# EasyEDA Pro project ECU_SMD.epro, board PCB
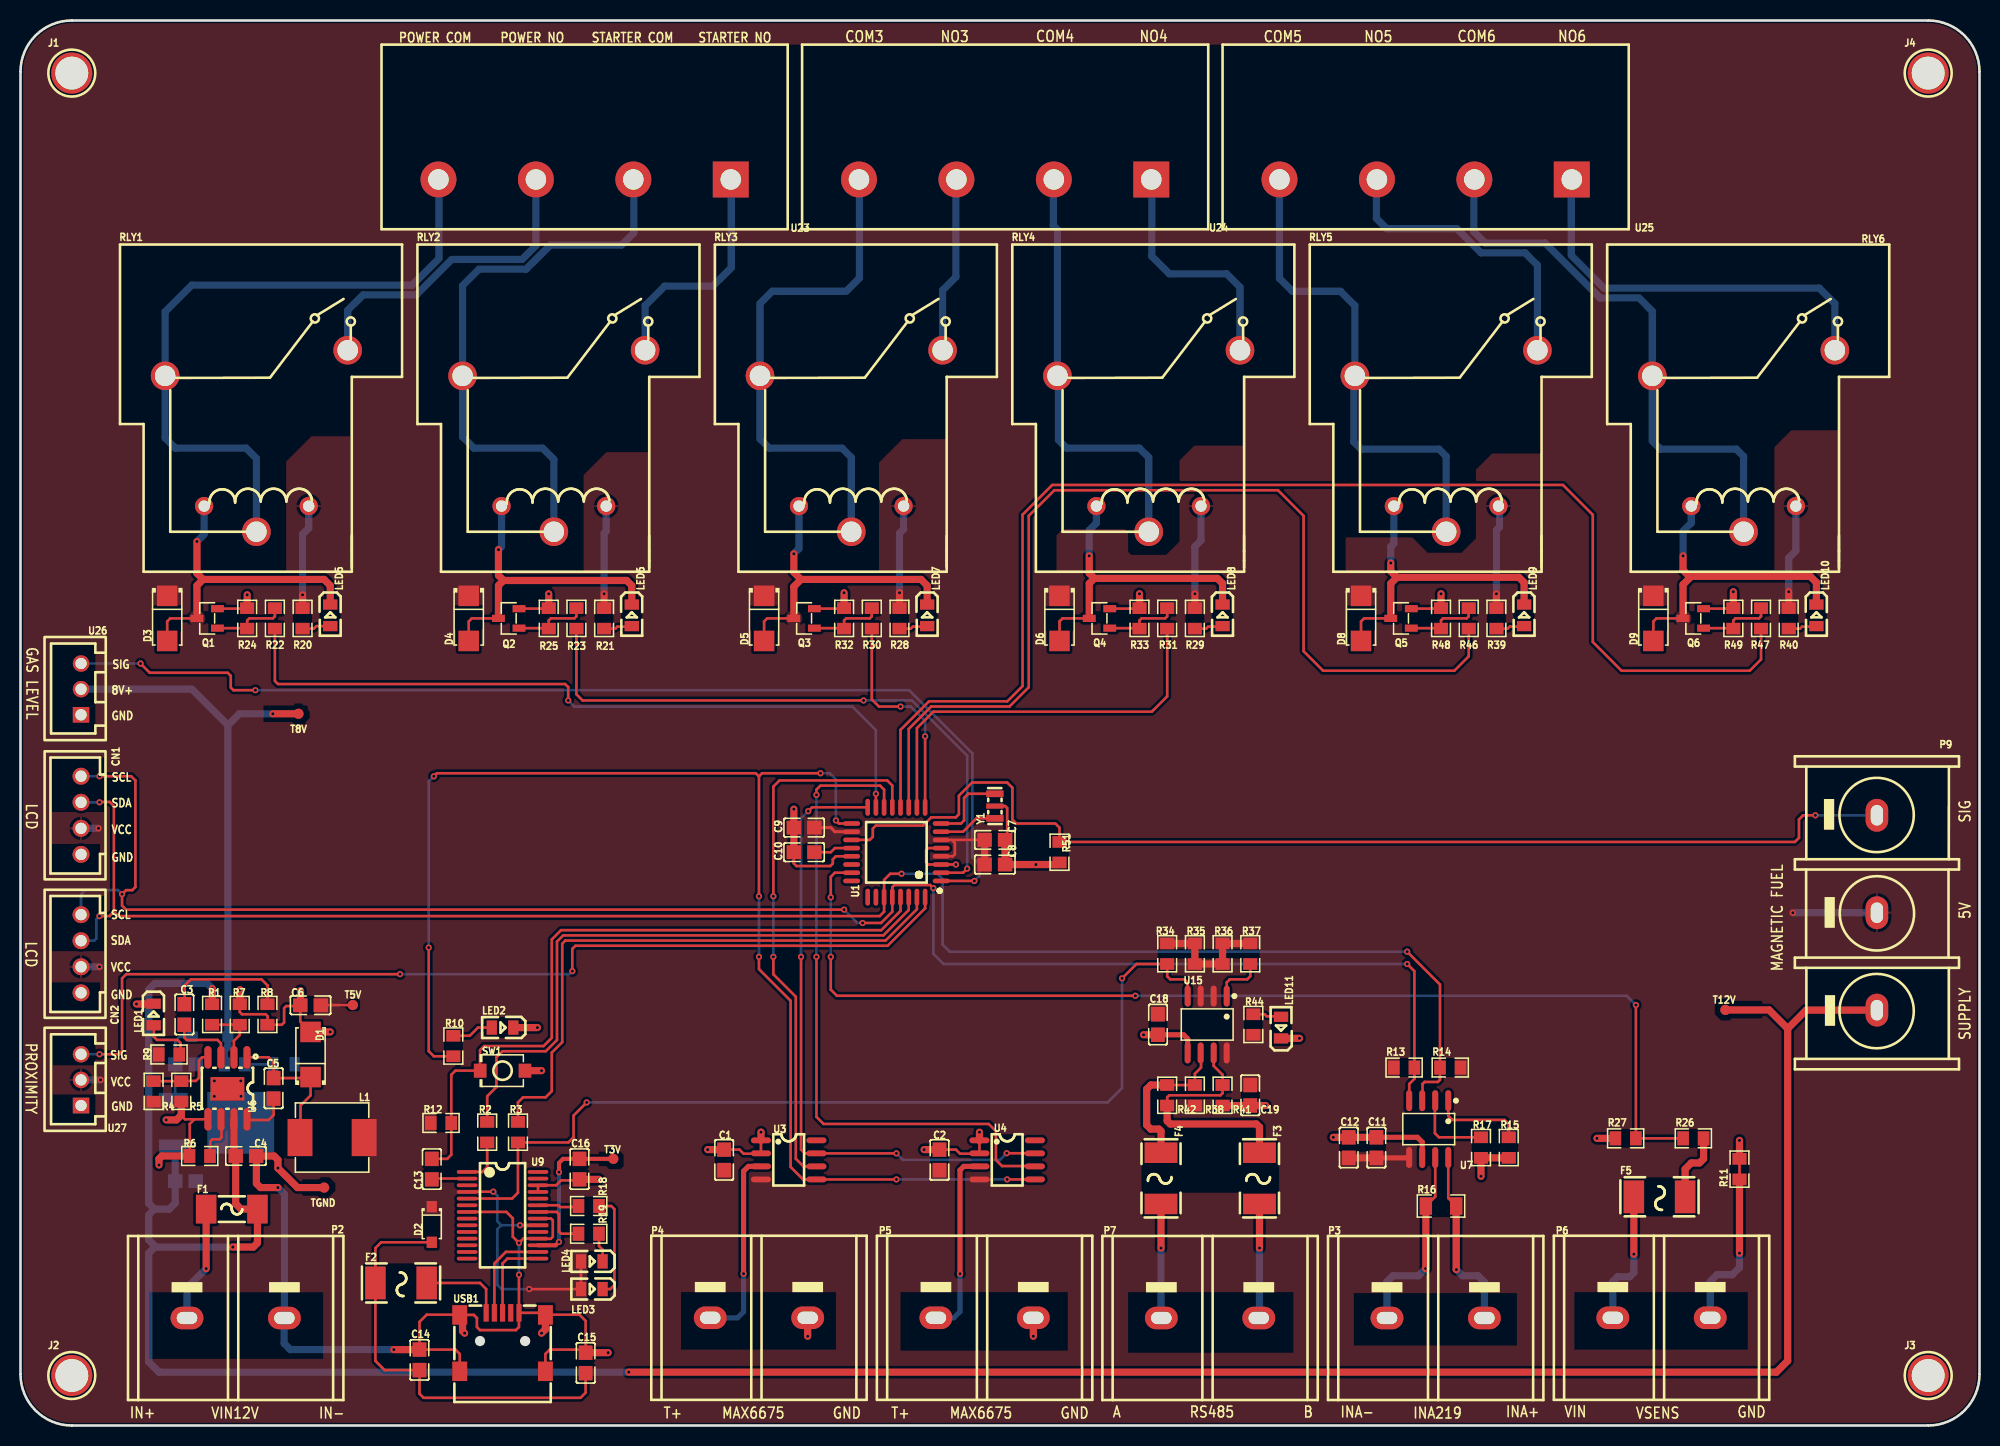
[diagram p2: board, top side]
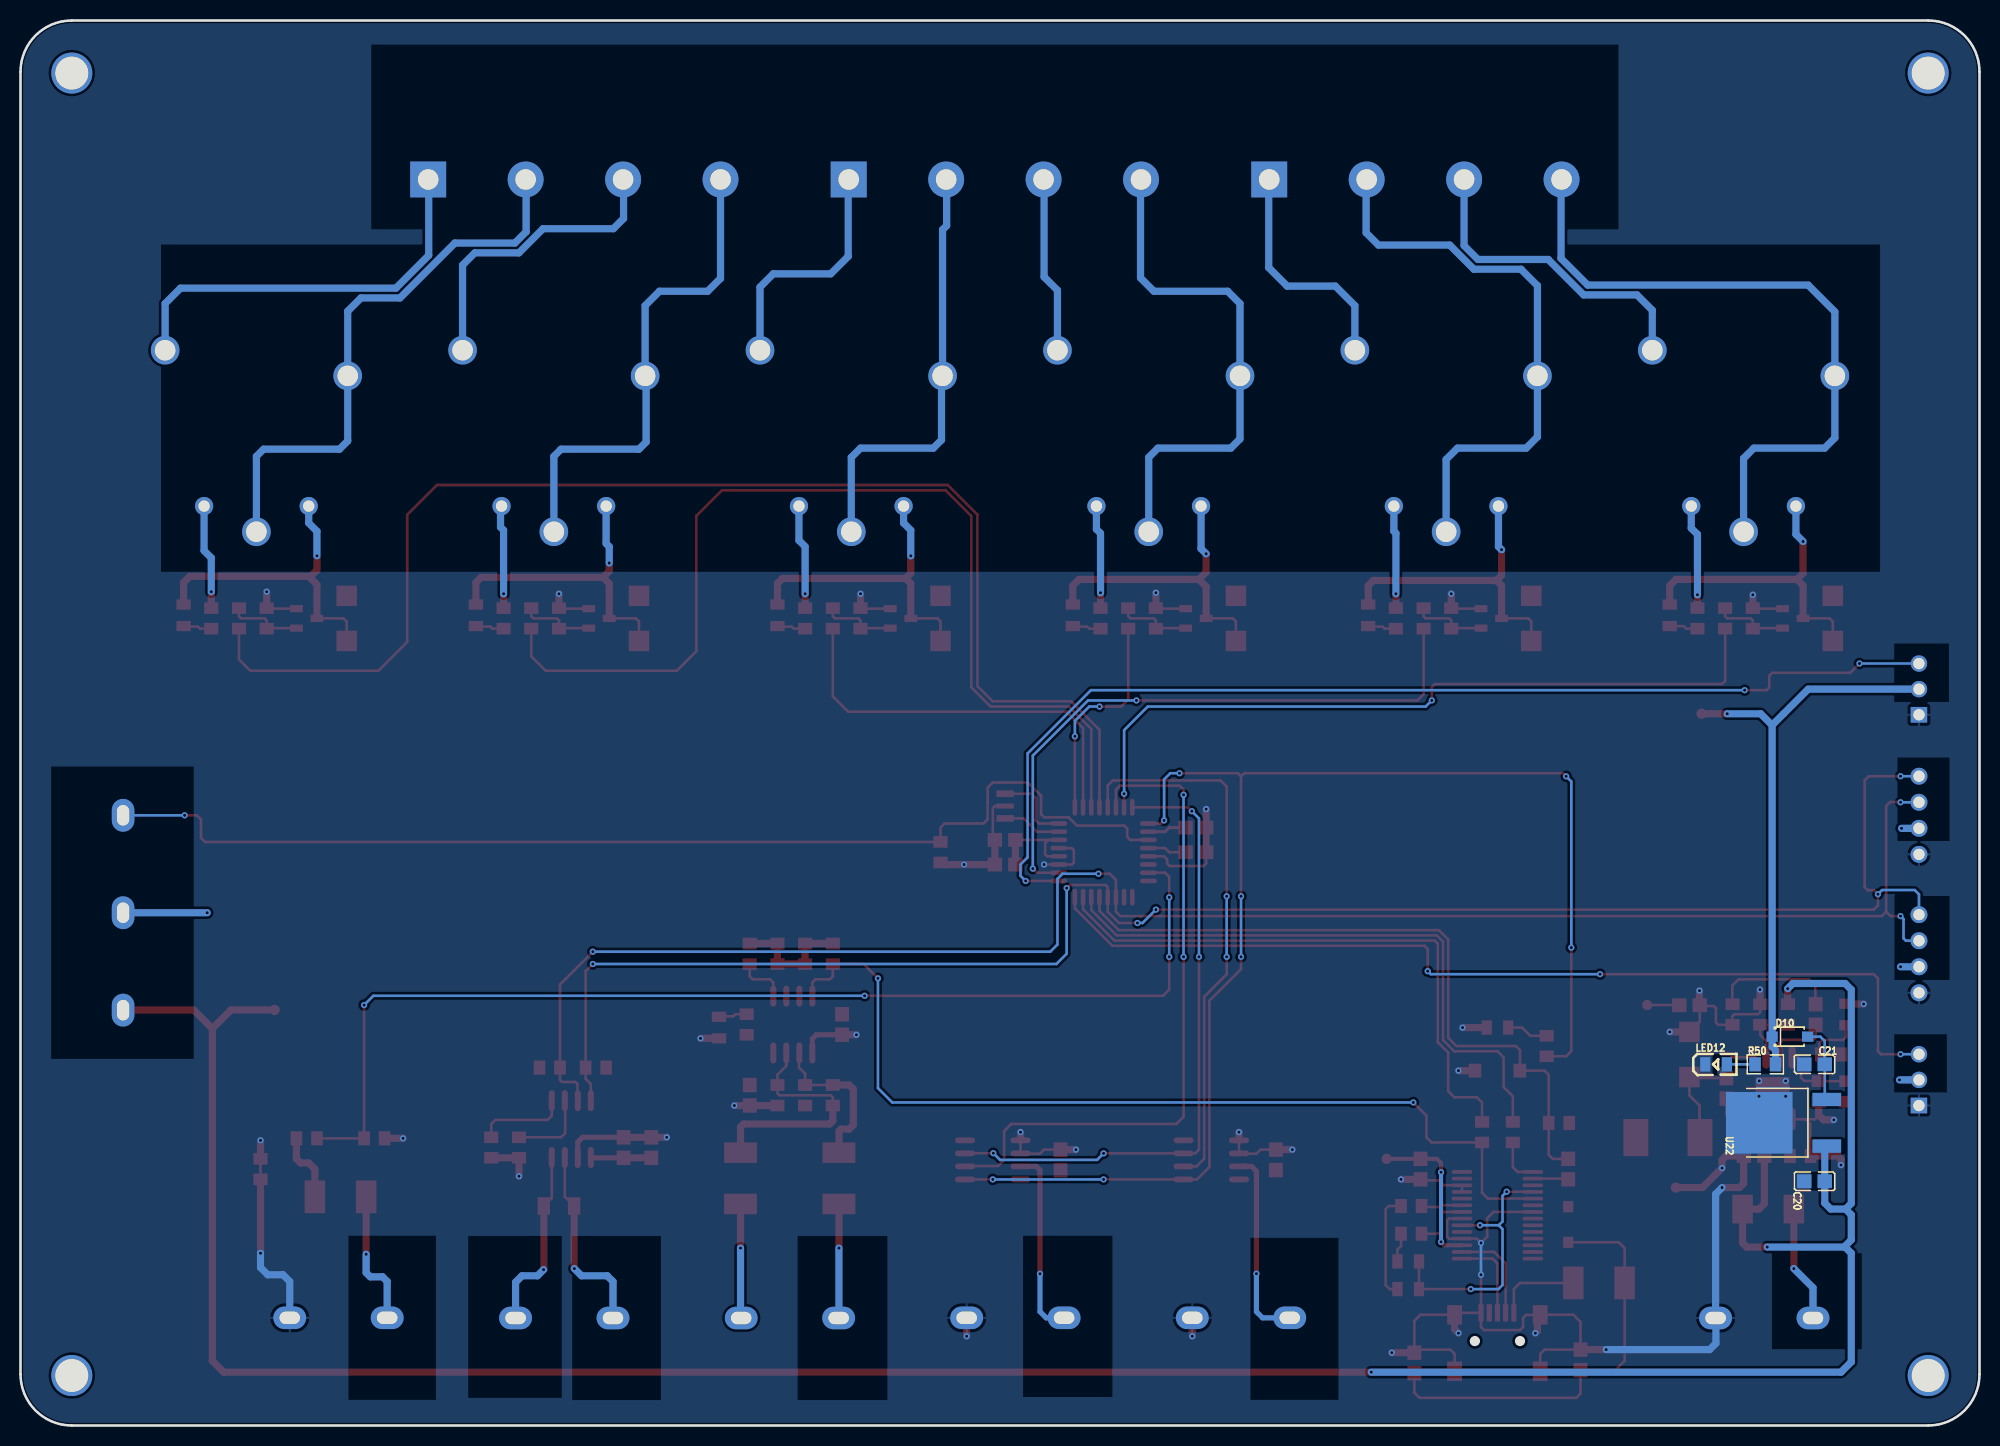
[diagram p3: board, bottom side, seen from below]

Outline 191 x 137 mm; copper layers: Top Layer, Bottom Layer. Coordinates in mm from the lower left corner of the outline.
Outline path: 0,132 0,5 arc(1.46,1.46) 5,0 186,0 arc(189.54,1.46) 191,5 191,132 arc(189.54,135.54) 186,137 5,137 arc(1.46,135.54) 0,132
Stack: Top Layer 0.035mm / Dielectric1 1.51mm FR4 er 4.5 / Bottom Layer 0.035mm

## Design rules (mm)
template: Custom Config
spacing copperThickness1oz (default): track to track 0.254, other pairs 0.152 to 0.3
spacing copperThickness2oz: track to track 0.203, other pairs 0.152 to 0.3
track width copperThickness1oz (default): min 0.127, default 0.254, max 2.54
track width copperThickness2oz: min 0.203, default 0.254, max 2.54
differential pair differentialPair (default): width min 0.127, default 0.254, max 2.54; gap min 0.152, default 0.152
via viaSize (default): diameter min 0.5, default 0.61, max 10; hole min 0.3, default 0.305, max 6.3

## Placement (name value [footprint] x y rotation side)
C1  100nF  [C0805]  68.6 25.9 270 top
C2  100nF  [C0805]  89.6 25.9 270 top
C3  150pF  [C0805]  15.98 40.08 270 top
C4  10uF  [C0805]  21.98 26.28 180 top
C5  100nF  [C0805]  24.68 32.88 90 top
C6  22uF  [C0805]  28.28 40.98 0 top
C7  1uF  [C0805]  95 57.1 180 top
C8  4.7uF  [C0805]  95 54.7 180 top
C9  1uF  [C0805]  76.4 58.3 0 top
C10  100nF  [C0805]  76.4 55.9 0 top
C11  10uF  [C0805]  132.2 27.1 270 top
C12  100nF  [C0805]  129.5 27.1 270 top
C13  100nF  [C0805]  40.1 25 270 top
C14  4.7uF  [C0805]  38.9 6.4 270 top
C15  100nF  [C0805]  55.1 6.1 270 top
C16  100nF  [C0805]  54.5 25 90 top
C18  10uF  [C0805]  110.9 39.1 90 top
C19  100nF  [C0805]  119.9 32.2 90 top
C20  330nF  [C0805]  16.08 23.82 180 bottom
C21  100nF  [C0805]  16.08 35.22 180 bottom
CN1  HCZZ0126-4  [CONN-TH_XH2.54-4P]  5.9 59.5 90 top
CN2  HCZZ0126-4  [CONN-TH_XH2.54-4P]  5.9 46 90 top
D1  SS34  [SMA_L4.3-W2.6-LS5.2-RD]  28.28 36.18 90 top
D2  1N4148W  [SOD-123F_L2.7-W1.6-LS3.8-RD]  40.1 19.6 270 top
D3  SS34  [SMA_L4.3-W2.6-LS5.2-RD]  14.3 78.7 270 top
D4  SS34  [SMA_L4.3-W2.6-LS5.2-RD]  43.7 78.7 270 top
D5  SS34  [SMA_L4.3-W2.6-LS5.2-RD]  72.5 78.7 270 top
D6  SS34  [SMA_L4.3-W2.6-LS5.2-RD]  101.3 78.7 270 top
D8  SS34  [SMA_L4.3-W2.6-LS5.2-RD]  130.7 78.7 270 top
D9  SS34  [SMA_L4.3-W2.6-LS5.2-RD]  159.2 78.7 270 top
D10  1N4148W  [SOD-123F_L2.7-W1.6-LS3.8-RD]  18.48 37.92 180 bottom
F1  TA2VT3  [FUSE-SMD_L6.1-W2.5]  20.6 21.1 0 top
F2  TA2VT1  [F2410]  37.1 13.9 0 top
F3  TA2VT1  [F2410]  120.8 24.1 270 top
F4  TA2VT1  [F2410]  111.2 24.1 270 top
F5  TA2VT1  [F2410]  159.8 22.3 0 top
J1  HOLE  [M2 Mounting Hole - Conductive]  5 132 0 top
J2  HOLE  [M2 Mounting Hole - Conductive]  5 5 0 top
J3  HOLE  [M2 Mounting Hole - Conductive]  186 5 0 top
J4  HOLE  [M2 Mounting Hole - Conductive]  186 132 0 top
L1  15uH  [IND-SMD_L7.0-W6.6_FXL0630]  30.38 28.08 180 top
LED1  KT-0805G  [LED0805-R-RD]  12.98 40.08 270 top
LED2  KT-0805G  [LED0805-R-RD]  47 38.8 180 top
LED3  KT-0805Y  [LED0805-R-RD]  55.7 13.3 180 top
LED4  KT-0805Y  [LED0805-R-RD]  55.7 16 180 top
LED5  KT-0805W  [LED0805-R-RD]  30.2 79 270 top
LED6  KT-0805W  [LED0805-R-RD]  59.6 79 270 top
LED7  KT-0805W  [LED0805-R-RD]  88.4 79 270 top
LED8  KT-0805W  [LED0805-R-RD]  117.2 79 270 top
LED9  KT-0805W  [LED0805-R-RD]  146.6 79 270 top
LED10  KT-0805W  [LED0805-R-RD]  175.1 79 270 top
LED11  KT-0805G  [LED0805-R-RD]  122.9 38.8 90 top
LED12  KT-0805G  [LED0805-R-RD]  25.68 35.22 180 bottom
P2  WJ45C-B-9.5-2P  [CONN-TH_2P-P9.50_WJ45C-B-2P]  20.98 10.48 180 top
P3  WJ45C-B-9.5-2P  [CONN-TH_2P-P9.50_WJ45C-B-2P]  137.98 10.48 180 top
P4  WJ45C-B-9.5-2P  [CONN-TH_2P-P9.50_WJ45C-B-2P]  72 10.5 180 top
P5  WJ45C-B-9.5-2P  [CONN-TH_2P-P9.50_WJ45C-B-2P]  94 10.5 180 top
P6  WJ45C-B-9.5-2P  [CONN-TH_2P-P9.50_WJ45C-B-2P]  160 10.5 180 top
P7  WJ45C-B-9.5-2P  [CONN-TH_2P-P9.50_WJ45C-B-2P]  115.98 10.48 180 top
P9  WJ45C-B-9.5-3P  [CONN-TH_3P-P9.50_WJ45C-B-3P]  181 50 270 top
Q1  AO3400A  [SOT-23-3_L2.9-W1.3-P1.90-LS2.4-BR]  18.2 78.7 0 top
Q2  AO3400A  [SOT-23-3_L2.9-W1.3-P1.90-LS2.4-BR]  47.6 78.7 0 top
Q3  AO3400A  [SOT-23-3_L2.9-W1.3-P1.90-LS2.4-BR]  76.4 78.7 0 top
Q4  AO3400A  [SOT-23-3_L2.9-W1.3-P1.90-LS2.4-BR]  105.2 78.7 0 top
Q5  AO3400A  [SOT-23-3_L2.9-W1.3-P1.90-LS2.4-BR]  134.6 78.7 0 top
Q6  AO3400A  [SOT-23-3_L2.9-W1.3-P1.90-LS2.4-BR]  163.1 78.7 0 top
R1  100kΩ  [R0805]  18.68 40.08 90 top
R2  1kΩ  [R0805]  45.5 28.6 90 top
R3  1kΩ  [R0805]  48.5 28.6 90 top
R4  43kΩ  [R0805]  12.98 32.58 270 top
R5  8.2kΩ  [R0805]  15.68 32.58 90 top
R6  100kΩ  [R0805]  17.48 26.28 0 top
R7  27kΩ  [R0805]  21.38 40.08 270 top
R8  100kΩ  [R0805]  24.08 40.08 90 top
R9  1kΩ  [R0805]  14.48 36.18 180 top
R10  1kΩ  [R0805]  42.2 37 270 top
R11  1kΩ  [R0805]  167.6 25 90 top
R12  1kΩ  [R0805]  41 29.5 180 top
R13  10kΩ  [R0805]  134.9 34.9 0 top
R14  10kΩ  [R0805]  139.4 34.9 0 top
R15  10kΩ  [R0805]  145.1 27.1 270 top
R16  100mΩ  [R1206]  138.5 21.4 0 top
R17  10kΩ  [R0805]  142.4 27.1 270 top
R18  1kΩ  [R0805]  55.4 21.4 0 top
R19  1kΩ  [R0805]  55.4 18.7 0 top
R20  1kΩ  [R0805]  27.5 78.7 90 top
R21  1kΩ  [R0805]  56.9 78.7 90 top
R22  1kΩ  [R0805]  24.8 78.7 90 top
R23  1kΩ  [R0805]  54.2 78.7 90 top
R24  10kΩ  [R0805]  22.1 78.7 90 top
R25  10kΩ  [R0805]  51.5 78.7 90 top
R26  30kΩ  [R0805]  163.1 28 0 top
R27  7.5kΩ  [R0805]  156.5 28 0 top
R28  1kΩ  [R0805]  85.7 78.7 90 top
R29  1kΩ  [R0805]  114.5 78.7 90 top
R30  1kΩ  [R0805]  83 78.7 90 top
R31  1kΩ  [R0805]  111.8 78.7 90 top
R32  10kΩ  [R0805]  80.3 78.7 90 top
R33  10kΩ  [R0805]  109.1 78.7 90 top
R34  10kΩ  [R0805]  111.8 46 90 top
R35  10kΩ  [R0805]  114.5 46 270 top
R36  10kΩ  [R0805]  117.2 46 90 top
R37  10kΩ  [R0805]  119.9 46 90 top
R38  20kΩ  [R0805]  114.5 32.2 270 top
R39  1kΩ  [R0805]  143.9 78.7 90 top
R40  1kΩ  [R0805]  172.4 78.7 90 top
R41  20kΩ  [R0805]  117.2 32.2 90 top
R42  120Ω  [R0805]  111.8 32.2 90 top
R44  1kΩ  [R0805]  120.2 39.1 270 top
R46  1kΩ  [R0805]  141.2 78.7 90 top
R47  1kΩ  [R0805]  169.7 78.7 90 top
R48  10kΩ  [R0805]  138.5 78.7 90 top
R49  10kΩ  [R0805]  167 78.7 90 top
R50  1kΩ  [R0805]  20.88 35.22 180 bottom
R51  220Ω  [R0805]  101.3 55.9 270 top
RLY1  SLA-5VDC-SL-A  [RELAY-TH_SLA-XXVDC-SL-A]  23 96 0 top
RLY2  SLA-5VDC-SL-A  [RELAY-TH_SLA-XXVDC-SL-A]  52 96 0 top
RLY3  SLA-5VDC-SL-A  [RELAY-TH_SLA-XXVDC-SL-A]  81 96 0 top
RLY4  SLA-5VDC-SL-A  [RELAY-TH_SLA-XXVDC-SL-A]  110 96 0 top
RLY5  SLA-5VDC-SL-A  [RELAY-TH_SLA-XXVDC-SL-A]  139 96 0 top
RLY6  SLA-5VDC-SL-A  [RELAY-TH_SLA-XXVDC-SL-A]  168 96 0 top
SW1  TS-1088R-02026  [SW-SMD_L3.9-W3.0-P4.45]  47 34.6 180 top
T3V  -  [Test-Point-0.5mm]  57.8 26 0 top
T5V  -  [Test-Point-0.5mm]  32.4 41 0 top
T8V  -  [Test-Point-0.5mm]  27.1 69.4 0 top
T12V  -  [Test-Point-0.5mm]  166.22 40.52 0 top
TGND  -  [Test-Point-0.5mm]  29.6 23.2 0 top
U1  ATMEGA328P-AU  [TQFP-32_L7.0-W7.0-P0.80-LS9.0-BL]  85.4 55.9 90 top
U3  MAX6675ISA+  [SOIC-8_L5.0-W4.0-P1.27-LS6.0-BL]  74.9 25.9 270 top
U4  MAX6675ISA+  [SOIC-8_L5.0-W4.0-P1.27-LS6.0-BL]  96.2 25.9 270 top
U6  MP1584EN  [SOIC-8_L4.9-W3.9-P1.27-LS6.0-BL-EP3.3]  20.18 32.88 180 top
U7  INA219AIDR  [SOIC-8_L4.9-W3.9-P1.27-LS6.0-BL]  137.3 28.9 180 top
U9  FT232RL  [SSOP-28_L10.2-W5.3-P0.65-LS7.8-BL]  47 20.5 270 top
U15  MAX485CSA+T  [SOIC-8_L4.9-W3.9-P1.27-LS6.0-BL]  115.7 39.1 180 top
U22  L78M08CDT-TR  [TO-252-2_L6.6-W6.1-P4.57-LS9.9-TL-CW]  18.18 29.52 0 bottom
U23  HB9500-9.5-4P  [CONN-TH_HB9500-9.5-4P]  55 121.5 180 top
U24  HB9500-9.5-4P  [CONN-TH_HB9500-9.5-4P]  96 121.5 180 top
U25  HB9500-9.5-4P  [CONN-TH_HB9500-9.5-4P]  137 121.5 180 top
U26  HCZZ0126-3  [CONN-TH_3P-P2.50_3PIN]  5.9 71.8 90 top
U27  HCZZ0126-3  [CONN-TH_3P-P2.50_3PIN]  5.9 33.7 90 top
USB1  UX-144S-ACP5  [MINI-USB-SMD_UX-144S-ACP5]  47 8.13 0 top
Y1  16MHz  [OSC-SMD_3P-L3.2-W1.3-P1.2-L]  95 60.4 90 top

## Footprints (pads in the part's own frame, mm; a bottom-side part is the same pattern mirrored in y, then rotated)
C0805
  rect 1.41x1.35 smd: 1(-1,0) 2(1,0)
CONN-TH_2P-P9.50_WJ45C-B-2P
  oval 3.2x2.2 hole 2x1.2: 1(-4.75,0) 2(4.75,0)
CONN-TH_3P-P2.50_3PIN
  rect 1.524x1.6 hole 1.1: 1(-2.5,0)
  round 1.6 hole 1.1: 2(0,0) 3(2.5,0)
CONN-TH_3P-P9.50_WJ45C-B-3P
  oval 3.2x2.2 hole 2x1.2: 1(-9.499,0) 2(0,0) 3(9.499,0)
CONN-TH_HB9500-9.5-4P
  rect 3.5x3.5 hole 2: 1(-14.25,0)
  round 3.5 hole 2: 2(-4.75,0) 3(4.75,0) 4(14.25,0)
CONN-TH_XH2.54-4P
  round 1.65 hole 1.1: 1(-3.81,0) 2(-1.27,0) 3(1.27,0) 4(3.81,0)
F2410
  rect 2x3.2 smd: 1(-2.5,0) 2(2.5,0)
FUSE-SMD_L6.1-W2.5
  rect 2x2.8 smd: 1(-2.5,0) 2(2.5,0)
IND-SMD_L7.0-W6.6_FXL0630
  rect 2.424x3.62 smd: 1(3.128,0) 2(-3.128,0)
LED0805-R-RD
  rect 1x1.399 smd: 1(1.05,0) 2(-1.05,0)
M2 Mounting Hole - Conductive
  round 4 hole 3.2x2.2: 1(0,-0.127)
MINI-USB-SMD_UX-144S-ACP5
  rect 0.5x1.7 smd: 1(-1.6,2.85) 2(-0.8,2.85) 3(0,2.85) 4(0.8,2.85) 5(1.6,2.85)
  rect 1.45x1.9 smd: 6(-4.175,2.65) 7(-4.175,-2.85) 8(4.175,-2.85) 9(4.175,2.65)
OSC-SMD_3P-L3.2-W1.3-P1.2-L
  rect 0.65x1.7 smd: 1(-1.2,0) 3(1.2,0)
  rect 0.5x1.7 smd: 2(0,0)
R0805
  rect 1.133x1.377 smd: 1(-1,0) 2(1,0)
R1206
  rect 1.208x1.701 smd: 1(-1.479,0) 2(1.479,0)
RELAY-TH_SLA-XXVDC-SL-A
  round 2.794 hole 2.002: 2(8.9,8.85)
  round 1.778 hole 1.103: 3(5.1,-6.349) 4(-5.1,-6.349)
  round 2.794 hole 2: 5(-8.9,6.351) 5(0,-8.85)
SMA_L4.3-W2.6-LS5.2-RD
  rect 2x2 smd: 1(-2.2,0) 2(2.2,0)
SOD-123F_L2.7-W1.6-LS3.8-RD
  rect 1.1x1 smd: 1(-1.735,0) 2(1.735,0)
SOIC-8_L4.9-W3.9-P1.27-LS6.0-BL
  oval 0.588x2.045 smd: 1(-1.905,-2.772) 2(-0.635,-2.772) 3(0.635,-2.772) 4(1.905,-2.772) 5(1.905,2.772) 6(0.635,2.772) 7(-0.635,2.772) 8(-1.905,2.772)
SOIC-8_L4.9-W3.9-P1.27-LS6.0-BL-EP3.3
  oval 0.7x2.2 smd: 1(-1.905,-3.022) 2(-0.635,-3.022) 3(0.635,-3.022) 4(1.905,-3.022) 5(1.905,3.022) 6(0.635,3.022) 7(-0.635,3.022) 8(-1.905,3.022)
  rect 3.3x2.3 smd: 9(0,0.051)
SOIC-8_L5.0-W4.0-P1.27-LS6.0-BL
  oval 0.569x1.95 smd: 1(-1.905,-2.705) 2(-0.635,-2.705) 3(0.635,-2.705) 4(1.905,-2.705) 5(1.905,2.705) 6(0.635,2.705) 7(-0.635,2.705) 8(-1.905,2.705)
SOT-23-3_L2.9-W1.3-P1.90-LS2.4-BR
  rect 1.25x0.7 smd: 1(1,-0.95) 2(1,0.95) 3(-1,0)
SSOP-28_L10.2-W5.3-P0.65-LS7.8-BL
  oval 0.364x2.015 smd: 1(-4.225,-3.455) 2(-3.575,-3.455) 3(-2.925,-3.455) 4(-2.275,-3.455) 5(-1.625,-3.455) 6(-0.975,-3.455) 7(-0.325,-3.455) 8(0.325,-3.455) 9(0.975,-3.455) 10(1.625,-3.455) 11(2.275,-3.455) 12(2.925,-3.455) 13(3.575,-3.455) 14(4.225,-3.455) 15(4.225,3.455) 16(3.575,3.455) 17(2.925,3.455) 18(2.275,3.455) 19(1.625,3.455) 20(0.975,3.455) 21(0.325,3.455) 22(-0.325,3.455) 23(-0.975,3.455) 24(-1.625,3.455) 25(-2.275,3.455) 26(-2.925,3.455) 27(-3.575,3.455) 28(-4.225,3.455)
SW-SMD_L3.9-W3.0-P4.45
  rect 1.23x1.36 smd: 1(-2.185,0) 2(2.185,0)
Test-Point-0.5mm
  round 1 smd: 1(0,0)
TO-252-2_L6.6-W6.1-P4.57-LS9.9-TL-CW
  rect 2.8x1.3 smd: 1(-3.292,2.273) 3(-3.292,-2.273)
  rect 6.5x6 smd: 2(3.292,0)
TQFP-32_L7.0-W7.0-P0.80-LS9.0-BL
  oval 0.45x1.65 smd: 1(-2.8,-4.369) 2(-2,-4.369) 3(-1.2,-4.369) 4(-0.4,-4.369) 5(0.4,-4.369) 6(1.2,-4.369) 7(2,-4.369) 8(2.8,-4.369) 17(2.8,4.369) 18(2,4.369) 19(1.2,4.369) 20(0.4,4.369) 21(-0.4,4.369) 22(-1.2,4.369) 23(-2,4.369) 24(-2.8,4.369)
  oval 1.65x0.45 smd: 9(4.381,-2.8) 10(4.381,-2) 11(4.381,-1.2) 12(4.381,-0.4) 13(4.381,0.4) 14(4.381,1.2) 15(4.381,2) 16(4.381,2.8) 25(-4.381,2.8) 26(-4.381,2) 27(-4.381,1.2) 28(-4.381,0.4) 29(-4.381,-0.4) 30(-4.381,-1.2) 31(-4.381,-2) 32(-4.381,-2.8)

## Nets
As in the schematic.

Pads without a net: J1 1; J2 1; J3 1; J4 1; U3 8; U4 8; U9 3 6 8 9 10 11 12 13 14 19 24 27 28; USB1 4

## Via types
v1: diameter 0.61, hole 0.305, Top Layer to Bottom Layer, 122 vias

## Routing (per net, layer and track width the routed paths; a pad name or vN(x,y) marks a point on that pad's centre or on a via; arc(x,y) is an arc through that point)
+3.3V: length 15.3
  Top Layer w0.4: U9.17 52.17,17.57 v1(52.5,17.9) ; T3V.1 C16.2 52.9,26 52.5,25.6 v1(52.5,24.7)
  Bottom Layer w0.4: v1(52.5,17.9) v1(52.5,24.7)
+5V: length 135.7
  Top Layer w0.254: U1.6 90.81,57.1 ; 90.81,57.1 91.1,56.81 91.1,55.7 90.9,55.5 U1.4 ; 90.81,57.1 C7.2 ; T5V.1 29.3,41 C6.2 ; v1(46.1,22.8) 43.57,22.8 U9.4 ; U9.20 v1(48.7,19.53) ; v1(49.6,13.3) LED3.1 LED4.1
  Top Layer w0.3: C9.2 79,58.3 79.4,57.9 U1.18
  Top Layer w0.5: U7.5 135.37,26.1 C11.2
  Top Layer w0.7: R21.2 v1(56.9,81.1) ; R39.2 v1(143.9,81.1) ; R29.2 v1(114.5,81.1) ; C12.2 C11.2 ; R34.2 R35.1 R35.2 R36.1 R36.2 R37.2 ; C8.2 C7.2 ; R28.2 v1(85.7,81.2) ; R20.2 v1(27.5,81) ; R40.2 v1(172.4,81.3)
  Bottom Layer w0.254: 46.88,19.53 46.5,19.9 46.5,22.4 v1(46.1,22.8) ; 46.88,19.53 v1(48.7,19.53) ; 46.88,19.53 46.5,19.15 46.5,13.7 46.9,13.3 v1(49.6,13.3)
  Bottom Layer w0.7: RLY5.3 144.2,89.55 144.2,87.6 143.9,87.3 v1(143.9,81.1) ; CN2.2 v1(7.7,44.73) ; v1(85.7,81.2) 85.7,87 86.1,87.4 RLY3.3 ; RLY6.3 173.1,85.3 172.4,84.6 v1(172.4,81.3) ; RLY4.3 115.1,86.3 114.5,85.7 v1(114.5,81.1) ; v1(56.9,81.1) 56.9,87 57.1,87.2 RLY2.3 ; v1(7.6,58.23) CN1.2 ; P9.2 v1(172.8,50) ; v1(27.5,81) 27.5,86.9 28.1,87.5 RLY1.3 ; U27.2 v1(7.8,33.7)
+8V: length 56.3
  Top Layer w0.7: T8V.1 v1(24.6,69.4)
  Bottom Layer w0.7: R50.2 19.88,36.58 20.22,36.92 D10.1 20.22,68.28 ; 20.22,68.28 21.34,69.4 v1(24.6,69.4) ; 20.22,68.28 16.7,71.8 U26.2
GND: length 271.1
  Top Layer w0.254: D1.2 27.28,39.38 C6.1 ; U9.7 47.38,20.82 48,20.2 48,18.4 v1(48.6,17.8) 49.03,18.22 U9.18 50.48,18.2 51.7,18.2 51.9,18.4 51.9,20 51.72,20.18 U9.21 ; 27.2,40.9 25.9,40.9 25.7,40.7 25.7,39.3 25.48,39.08 R8.1 24.1,39.1 24.1,39.9 23.9,40.1 21.6,40.1 21.38,40.32 R7.1 ; 16.95,29.85 16.05,29.85 15.7,30.2 ; 16.95,29.85 16.5,29.4 16.5,26.3 R6.1 ; 16.95,29.85 U6.5 ; 15.7,31.55 R5.1 ; v1(91.2,54.7) U1.3 88.5,54.7 88.3,54.9 88.3,56.1 88.5,56.3 U1.5 ; R49.2 166.95,79.65 Q6.2 ; R25.2 51.45,79.65 Q2.2 ; C10.1 75.4,54.8 75.65,54.55 78.95,54.55 79.2,54.8 79.2,55.2 79.5,55.5 U1.21 ; U9.25 U9.26 52.22,23.43 52.7,23.9 54.4,23.9 C16.1 ; R32.2 80.25,79.65 Q3.2 ; R33.2 109.05,79.65 Q4.2 ; Y1.2 96,60.4 96.2,60.2 96.2,57.3 C7.1 ; Q1.2 22.05,79.65 R24.2 ; USB1.5 50.97,10.98 USB1.9 51.19,10.8 54.5,10.8 55.1,10.2 C15.1 54.8,7.4 51.6,7.4 51.17,6.97 USB1.8 ; USB1.5 v1(48.6,14.7) ; USB1.5 48.6,9.6 48.3,9.3 44.8,9.3 44.5,9.6 44.5,10.48 44.2,10.78 USB1.6 ; U3.1 U3.2 72.16,26.5 70.5,26.5 70.1,26.9 C1.1 ; 93.5,27.81 93.5,26.53 93.46,26.5 91.6,26.5 91.2,26.9 C2.1 ; R48.2 138.45,79.65 Q5.2 ; 42.81,10.8 39.6,10.8 38.9,10.1 C14.1 42.4,7.4 42.83,6.97 USB1.7 ; R11.2 R11.1
  Top Layer w0.5: U15.5 113.79,37.71 113.4,38.1 C18.1 ; C11.1 136.2,28.1 136.66,27.63 136.66,26.13
  Top Layer w0.7: LED1.2 12.95,41.1 v1(11.3,41.1) ; C16.1 v1(56.4,24) ; v1(50.8,9) 51.17,9.38 USB1.9 ; R15.2 R17.2 v1(142.4,24.3) ; v1(27.3,42.4) 27.3,41 C6.1 ; v1(21.4,42.5) 21.4,41.1 R7.1 ; C18.1 v1(109.5,38.1) ; USB1.6 42.83,10.58 43.1,10.31 43.1,9.2 v1(43.3,9) ; v1(93.5,28.6) 93.5,27.81 93.5,27.81 ; U3.1 72.19,28.59 v1(72.2,28.6) ; C12.1 C11.1 ; v1(13.5,25.4) 13.5,26 13.78,26.28 R6.1 ; C2.1 v1(88.1,26.9) ; v1(25.1,23.2) 23.4,23.2 23,23.6 23,26.25 C4.1 24.72,26.28 25.1,25.9 v1(25.1,25.1) 27,23.2 TGND.1 ; R24.2 v1(22.1,81) ; R41.1 C19.1 v1(121.4,31.2) ; R11.1 v1(167.6,16.8) ; R25.2 v1(51.5,81.1) ; R32.2 v1(80.3,81.2) ; SW1.1 v1(50.8,34.6) ; R11.2 v1(167.6,27.8) ; C15.1 v1(57.3,7.1) ; LED11.2 v1(124.7,37.75) ; R5.1 15.68,30.28 15.2,29.8 v1(14.2,29.8) ; R51.2 101.1,54.7 v1(99,54.7) C8.1 C7.1 ; R49.2 v1(167,81.3) ; R48.2 v1(138.5,81.1) ; C14.1 v1(36.4,7.4) ; R27.1 v1(153.7,28) ; R33.2 v1(109.1,81.1) ; v1(75.4,60.1) C9.1 C10.1 ; P4.1 v1(76.75,8.7) ; C1.1 v1(67,26.9) ; LED2.2 v1(50.4,38.8) ; 129.4,28.1 v1(128,28.1) ; D1.2 v1(30.2,38.38) ; P5.1 v1(98.75,8.7)
  Bottom Layer w0.254: v1(48.6,17.8) v1(48.6,14.7)
  Bottom Layer w0.7: v1(25.1,23.2) 25.73,22.57 P2.1 25.7,10.45 25.7,8 26.3,7.4 v1(36.4,7.4) ; P6.1 164.75,14.05 165.4,14.7 166.9,14.7 167.6,15.4 v1(167.6,16.8)
  vias: v1(18.9,33.6) v1(18.89,32.1) v1(21.47,33.6) v1(21.5,32.1)
A: length 15.5
  Top Layer w0.254: U15.6 115.1,36.29 115.1,34.9 114.5,34.3 R38.1 R42.2
  Top Layer w0.7: F4.1 111.2,28.7 111,28.9 110.2,28.9 109.8,29.3 109.8,32.8 110.2,33.2 R42.2
A0: length 109.9
  Top Layer w0.254: v1(79,45.7) 79,42.5 79.6,41.9 v1(108.7,41.9) ; v1(157.5,41) R27.2 R26.1 ; U1.23 79.4,53.9 79,53.5 v1(79,51.5)
  Bottom Layer w0.254: v1(157.5,41) 156.6,41.9 v1(108.7,41.9) ; v1(79,51.5) v1(79,45.7)
A6: length 111
  Top Layer w0.254: U1.19 82.8,57.1 83.1,57.4 83.1,58.2 83.4,58.5 88,58.5 88.8,59.3 91.19,59.3 91.49,59.6 91.49,61.41 92.78,62.7 96.2,62.7 96.71,62.19 96.71,59.09 97.1,58.7 100.9,58.7 101.3,58.3 R51.1 173,56.9 173.4,57.3 173.4,59.1 173.8,59.5 v1(175,59.5)
  Bottom Layer w0.254: v1(175,59.5) P9.1
AREF: length 3.8
  Top Layer w0.254: U1.20 79.4,56.3 79,55.9 C10.2
B: length 23.9
  Top Layer w0.254: 116.34,36.33 116.34,35.06 117.2,34.2 R41.2 117.2,32.4 117,32.2 112,32.2 111.8,32 R42.1
  Top Layer w0.7: F3.1 120.8,29.1 120.5,29.4 112.1,29.4 111.8,29.7 R42.1
COM1: length 65.8
  Bottom Layer w0.7: U23.4 40.8,121.45 40.8,113.8 38.2,111.2 16.7,111.2 14.1,108.6 RLY1.5 14.1,96.3 15.1,95.3 22,95.3 23,94.3 RLY1.5
COM2: length 55.7
  Bottom Layer w0.7: RLY2.5 52,94.2 50.9,95.3 44.2,95.3 43.1,96.4 RLY2.5 43.1,111.15 44.7,112.75 49.3,112.75 51.65,115.1 58.6,115.1 59.8,116.3 59.8,121.45 U23.2
COM3: length 50.5
  Bottom Layer w0.7: U24.4 81.8,121.45 81.8,111.9 80.5,110.6 73.3,110.6 72.1,109.4 RLY3.5 72.1,96.2 73,95.3 80.1,95.3 81,94.4 RLY3.5
COM4: length 42.4
  Bottom Layer w0.254: 101.2,102.25 RLY4.5
  Bottom Layer w0.7: U24.2 100.7,121.45 100.7,117 101.1,116.6 RLY4.5 ; RLY4.5 110,94.4 109.1,95.3 102,95.3 101.2,96.1 101.2,102.25
COM5: length 48.4
  Bottom Layer w0.254: 130,102.25 RLY5.5
  Bottom Layer w0.7: RLY5.5 139,94.5 138.3,95.2 130.7,95.2 130,95.9 130,102.25 ; RLY5.5 130.1,109.2 128.7,110.6 124,110.6 122.75,111.85 U25.4
COM6: length 55.2
  Bottom Layer w0.7: U25.2 141.7,121.45 141.7,116.4 142.8,115.3 148.65,115.3 154,109.95 157.8,109.95 159.1,108.65 RLY6.5 159.1,96 159.9,95.2 167.3,95.2 168,94.5 RLY6.5
D2: length 94.7
  Top Layer w0.254: v1(37,44.01) 10.31,44.01 9.9,43.6 9.9,36.5 9.6,36.2 v1(7.7,36.2) ; U1.32 88.2,50.43 84.55,46.78 54.1,46.78 53.8,46.48 v1(53.8,44.3)
  Bottom Layer w0.254: v1(53.8,44.3) 53.51,44.01 v1(37,44.01) ; U27.3 v1(7.7,36.2)
D3: length 107.4
  Top Layer w0.254: U1.1 v1(93,53.1) ; v1(22.9,71.7) 20.75,71.7 20.5,71.95 20.5,73.1 20.2,73.4 12.6,73.4 v1(11.7,74.3)
  Bottom Layer w0.254: U26.3 v1(11.7,74.3) ; v1(93,53.1) 93.5,53.6 93.5,54.71 92.81,55.4 92.81,65.53 86.64,71.7 v1(22.9,71.7)
D4: length 60.7
  Top Layer w0.254: v1(82.2,70.7) 54.8,70.7 54.2,71.3 R23.1 ; v1(92.3,54.3) 91.9,53.9 U1.2
  Bottom Layer w0.254: v1(92.3,54.3) 92.3,65.32 86.92,70.7 v1(82.2,70.7)
D5: length 21.4
  Top Layer w0.254: U1.9 v1(88.2,67.2) ; v1(85.8,70.1) 83.7,70.1 83,70.8 R30.1
  Bottom Layer w0.254: v1(85.8,70.1) 86.8,70.1 88.2,68.7 v1(88.2,67.2)
D6: length 40
  Top Layer w0.254: R31.1 111.8,71.1 110.3,69.6 89,69.6 87.4,68 U1.10
D7: length 100
  Top Layer w0.254: U1.11 86.6,67.92 88.79,70.11 96.43,70.11 98.3,71.98 98.3,88.7 100.8,91.2 122.6,91.2 125.1,88.7 125.1,75.5 127,73.6 139.8,73.6 141.2,75 R46.1
D8: length 129.4
  Top Layer w0.254: U1.12 85.8,67.84 88.58,70.62 96.22,70.62 97.7,72.1 97.7,88.82 100.59,91.71 150.39,91.71 153.3,88.8 153.3,76.4 156.1,73.6 168.6,73.6 169.7,74.7 R47.1
D9: length 53.7
  Top Layer w0.254: v1(73.4,51.6) 73.4,62.3 74,62.9 84.5,62.9 85,62.4 U1.13 ; v1(73.4,45.7) 73.4,44 75.59,41.81 75.59,26.01 76.33,25.26 77.61,25.26
  Bottom Layer w0.254: v1(73.4,51.6) v1(73.4,45.7)
D10: length 65.5
  Top Layer w0.254: U1.14 84.2,62 83.81,62.39 77.99,62.39 77.6,62 v1(77.6,61.5) ; 98.91,25.26 98.87,25.3 95.7,25.3 95.1,25.9 95.1,28.7 94.4,29.4 78.3,29.4 77.6,30.1 v1(77.6,45.7)
  Bottom Layer w0.254: v1(77.6,61.5) v1(77.6,45.7)
D+: length 8.5
  Top Layer w0.254: U9.15 47.47,16.28 47,15.8 USB1.3
D-: length 9.5
  Top Layer w0.254: USB1.2 46.2,15.8 47.33,16.93 U9.16
IN12: length 11.4
  Top Layer w0.7: F1.1 v1(18.1,15.3)
  Bottom Layer w0.7: v1(18.1,15.3) 16.23,13.43 P2.2
INA+: length 18
  Top Layer w0.254: 139.98,21.4 139.21,22.17 U7.8
  Top Layer w0.7: v1(140,15.2) 139.98,15.22 139.98,21.4
  Bottom Layer w0.7: P3.1 142.73,13.97 142.1,14.6 140.6,14.6 v1(140,15.2)
INA-: length 19.1
  Top Layer w0.254: U7.7 137.94,22.31 R16.1
  Top Layer w0.7: R16.1 137.02,15.32 v1(137,15.3)
  Bottom Layer w0.7: P3.2 133.23,14.03 133.8,14.6 136.3,14.6 v1(137,15.3)
MISO: length 62.7
  Top Layer w0.254: U4.7 98.89,26.55 v1(96.15,26.55) ; v1(85.4,26.53) U3.7 76.47,26.53 76.1,26.9 v1(76.1,45.7) ; U1.16 77.18,60.28 v1(76.8,59.9)
  Bottom Layer w0.254: v1(85.4,26.53) 86.03,25.9 95.5,25.9 v1(96.15,26.55) ; v1(76.8,59.9) 76.1,59.2 v1(76.1,45.7)
MOSI: length 74
  Top Layer w0.254: U1.15 v1(83.4,61.6) ; v1(53.4,70.7) 53.4,72 53.1,72.3 25.1,72.3 24.8,72.6 R22.1
  Bottom Layer w0.254: v1(83.4,61.6) 83.4,67.8 81.1,70.1 54,70.1 v1(53.4,70.7)
NO1: length 31.3
  Bottom Layer w0.7: RLY1.2 31.9,108.75 33.4,110.25 38.59,110.25 42.05,113.7 48.9,113.7 50.25,115.05 U23.3
NO2: length 22.9
  Bottom Layer w0.7: U23.1 69.3,121.45 69.3,112.9 67.5,111.1 62.8,111.1 60.9,109.2 RLY2.2
NO3: length 17.2
  Bottom Layer w0.7: RLY3.2 89.9,110.7 91.2,112 91.2,121.45 U24.3
NO4: length 23.5
  Bottom Layer w0.7: RLY4.2 118.9,111 117.6,112.3 112,112.3 110.3,114 110.3,121.45 U24.1
NO5: length 29.7
  Bottom Layer w0.7: RLY5.2 147.9,113.15 146.7,114.35 142.41,114.35 140.05,116.7 133.2,116.7 132.2,117.7 132.2,121.45 U25.3
NO6: length 39.6
  Bottom Layer w0.7: RLY6.2 176.9,109.4 175.4,110.9 154.4,110.9 151.2,114.1 151.2,121.45 U25.1
RESET: length 68.4
  Top Layer w0.254: C13.1 41.6,26 42,26.4 R12.1 42,34.2 42.4,34.6 SW1.2 44.8,34.62 44.8,36.6 45.2,37 51,37 51.8,37.8 51.8,47.4 52.7,48.3 83.92,48.3 85.8,50.18 U1.29
RX: length 4.6
  Top Layer w0.254: R2.1 45.5,25.2 45.03,24.72 U9.1
SCK: length 138.8
  Top Layer w0.254: U1.17 79.8,58.7 v1(79.5,59) ; 72,63.29 71.69,63.6 40.6,63.6 v1(40.3,63.3) ; 72,63.29 v1(72,51.6) ; 72,63.29 72,63.3 72.3,63.6 v1(78,63.6) ; v1(39.8,46.6) 39.8,36.5 40.3,36 R10.2 ; v1(96.2,24) U4.5 ; v1(85.4,24) U3.5 76.3,24 75.08,25.21 75.08,41.42 72,44.5 v1(72,45.7)
  Bottom Layer w0.254: v1(79.5,59) 79.5,63 78.9,63.6 v1(78,63.6) ; v1(40.3,63.3) 39.8,62.8 v1(39.8,46.6) ; v1(72,45.7) v1(72,51.6) ; v1(85.4,24) v1(96.2,24)
SCL: length 174.6
  Top Layer w0.254: v1(80.3,50.3) 10.3,50.3 9.9,50.7 v1(9.9,51.81) 10.29,52.2 10.9,52.2 11.2,52.5 11.2,62.9 10.79,63.31 v1(7.7,63.31) ; v1(89,52.4) 88.7,52.7 85.2,52.7 85,52.5 U1.28 85,50.1 83.9,49 v1(82.1,49) ; U7.4 135.4,31.68 135.4,33.3 135.9,33.8 R13.2 135.9,44.3 v1(135.2,45)
  Bottom Layer w0.254: v1(82.1,49) 81.6,49 v1(80.3,50.3) ; v1(7.7,63.31) CN1.4 ; v1(9.9,51.81) 9.5,52.21 6.31,52.21 5.9,51.8 CN2.4 ; v1(135.2,45) 90,45 89,46 v1(89,52.4)
SDA: length 173.2
  Top Layer w0.254: 9.1,50.1 8.67,49.67 v1(7.7,49.67) ; 9.1,50.1 9.53,49.67 83.77,49.67 84.2,50.1 U1.27 84.2,53.2 84.8,53.8 v1(85.9,53.8) ; 9.1,50.1 9.1,60.4 8.7,60.8 7.73,60.8 v1(7.7,60.77) ; v1(135.2,46.2) 138.4,43 R14.1 138.4,33.7 138.2,33.5 136.9,33.5 136.7,33.3 136.7,31.71 136.66,31.67
  Bottom Layer w0.254: v1(7.7,60.77) CN1.3 ; v1(7.7,49.67) 7.4,49.37 7.4,47.5 7.17,47.27 CN2.3 ; v1(135.2,46.2) 90.6,46.2 89.9,46.9 89.9,53.3 89.4,53.8 v1(85.9,53.8)
SUPPLY: length 286.9
  Top Layer w0.7: P9.3 174.1,40.5 172.3,38.7 ; v1(18.7,42.6) 18.7,41.1 R1.2 ; U6.7 20.81,26.44 C4.2 20.98,21.62 21.5,21.1 F1.2 23.1,17.8 22.7,17.4 v1(20.7,17.4) ; v1(59.3,5.2) 171.2,5.2 172.3,6.3 172.3,38.7 ; 172.3,38.7 170.48,40.52 T12V.1
  Bottom Layer w0.7: 13.06,21.1 12.5,21.66 12.5,42.5 13.1,43.1 18.2,43.1 v1(18.7,42.6) ; 13.06,21.1 12.5,20.54 12.5,18.1 13.2,17.4 ; 13.06,21.1 14.5,21.1 15.08,21.68 C20.2 15.08,27.05 U22.1 ; 13.2,17.4 13.1,17.4 12.5,16.8 12.5,6.2 13.5,5.2 v1(59.3,5.2) ; 13.2,17.4 v1(20.7,17.4)
T1+: length 19.1
  Top Layer w0.5: v1(70.5,14.8) 70.5,24.8 70.97,25.26 72.19,25.26
  Bottom Layer w0.5: v1(70.5,14.8) 70.5,11.1 69.9,10.5 P4.2
T2+: length 18.4
  Top Layer w0.5: 93.5,25.26 91.97,25.26 91.6,24.9 v1(91.6,14.8)
  Bottom Layer w0.5: P5.2 91,10.5 91.6,11.1 v1(91.6,14.8)
TX: length 92.9
  Top Layer w0.254: U15.4 113.79,43.2 113.5,43.5 112.1,43.5 111.8,43.8 R34.1 108.8,45 v1(107.4,43.6) ; U9.5 47.92,22.12 48.5,22.7 R3.1 53.42,27.6 53.92,28.1 53.92,30.22 v1(55.2,31.5)
  Bottom Layer w0.254: v1(107.4,43.6) 107.4,32.9 106,31.5 v1(55.2,31.5)
VOLTIN: length 6.9
  Top Layer w0.7: F5.2 162.3,25 162.9,25.6 163.7,25.6 164.1,26 R26.2
VUSB: length 42.2
  Top Layer w0.254: C15.2 55.1,3.2 54.6,2.7 39.3,2.7 38.9,3.1 C14.2 35.5,5.4 34.6,6.3 F2.1 34.6,17.3 35.17,17.87 D2.2
$1N730: length 6.1
  Top Layer w0.254: U6.2 20.8,35.91 20.8,37.5 21.38,38.08 R7.2 R1.1
$1N855: length 4.5
  Top Layer w0.254: R6.2 18.5,26.3 18.5,27.7 18.7,27.9 19.4,27.9 19.6,28.1 19.6,29.8 U6.6
$1N908: length 14.3
  Top Layer w0.254: L1.1 27.3,28.13 27.3,31.2 28.28,32.18 D1.1 28.18,33.88 C5.2 24.68,35.42 24.2,35.9 U6.1
$1N914: length 4.4
  Top Layer w0.254: U6.8 22.14,29.8 24.2,29.8 24.68,30.28 C5.1
$1N1025: length 6.4
  Top Layer w0.254: C3.2 15.98,37.82 16.2,37.6 19.2,37.6 19.54,37.26 U6.3
$1N1104: length 12.3
  Top Layer w0.254: C3.1 16,41.1 16,42.9 16.6,43.5 23.5,43.5 24.1,42.9 24.1,41.1 R8.2
$1N1311: length 7.3
  Top Layer w0.254: U6.4 17.7,35.9 17.4,35.6 17.4,33.9 17.1,33.6 15.7,33.6 R5.2 R4.1
$1N1843: length 5.2
  Top Layer w0.254: LED1.1 13,39 13,37.9 13.3,37.6 15.3,37.6 15.6,37.3 15.6,36.3 R9.1
$1N2823: length 8.4
  Top Layer w0.254: F2.2 44.8,13.9 45.4,13.3 USB1.1
$1N3355: length 10.3
  Top Layer w0.254: R18.2 57.6,21.4 57.9,21.1 57.9,13.7 57.5,13.3 LED3.2
$1N3359: length 2.8
  Top Layer w0.254: LED4.2 56.75,17.15 56.4,17.5 R19.2
$1N3364: length 4.1
  Top Layer w0.254: R18.1 54.3,21.3 52.6,21.3 52.42,21.47 U9.23
$1N3369: length 5.8
  Top Layer w0.254: U9.22 52.28,20.82 52.5,20.6 52.5,18.9 52.7,18.7 R19.1
$1N3507: length 3.5
  Top Layer w0.254: C13.2 40.17,24.07 U9.2
$1N4715: length 4.1
  Top Layer w0.254: R10.1 43.8,38 44.6,38.8 LED2.1
$1N5069: length 59.7
  Top Layer w0.254: U1.30 86.6,50.26 84.13,47.79 52.91,47.79 52.31,47.19 52.31,37.59 51.21,36.49 46.99,36.49 46.4,35.9 46.4,33 45.5,32.1 R2.2
$1N5110: length 57.6
  Top Layer w0.254: R3.2 48.5,31.5 49,32 51.2,32 51.8,32.6 51.8,36.36 52.82,37.38 52.82,46.98 53.12,47.28 84.34,47.28 87.4,50.34 U1.31
$1N5823: length 5.8
  Top Layer w0.254: U1.7 91.9,57.9 93.2,59.2 Y1.1
$1N5832: length 7.7
  Top Layer w0.254: Y1.3 92.4,61.6 92,61.2 92,59 91.7,58.7 U1.8
$1N9594: length 7.9
  Top Layer w0.254: R17.1 138.3,28.1 137.9,28.5 137.9,31.64 U7.2
$1N9598: length 9
  Top Layer w0.254: U7.1 139.21,30.19 139.6,29.8 144.7,29.8 145.1,29.4 R15.1
$1N11065: length 2.8
  Top Layer w0.254: LED11.1 122.85,39.9 121.5,39.9 121.3,40.1 R44.1
$1N11066: length 5.1
  Top Layer w0.254: R37.1 119.9,43.8 119.6,43.5 117.9,43.5 117.6,43.2 U15.1
$1N11468: length 31.2
  Top Layer w0.254: Q1.3 14.6,78.7 14.3,78.4 D3.2
  Top Layer w0.7: LED5.2 30.2,81.9 29.6,82.5 17.8,82.5 ; 17.8,82.5 17.2,83.1 v1(17.2,86.2) ; 17.8,82.5 17.2,81.9 Q1.3
  Bottom Layer w0.7: RLY1.4 17.9,86.9 v1(17.2,86.2)
$1N11469: length 7.4
  Top Layer w0.254: Q1.1 22.05,77.75 R24.1 22.1,78.5 22.3,78.7 24.6,78.7 24.8,78.9 R22.2
$1N11471: length 2.8
  Top Layer w0.254: R20.1 28.6,77.7 28.85,77.95 LED5.1
$1N14052: length 31
  Top Layer w0.254: Q2.3 44,78.7 43.7,78.4 D4.2
  Top Layer w0.7: v1(46.6,85.4) 46.6,82.9 47.1,82.4 ; 47.1,82.4 46.6,81.9 Q2.3 ; 47.1,82.4 59.1,82.4 59.6,81.9 LED6.2
  Bottom Layer w0.7: v1(46.6,85.4) 46.9,85.7 RLY2.4
$1N14059: length 7.4
  Top Layer w0.254: Q2.1 51.45,77.75 R25.1 51.5,78.5 51.7,78.7 54,78.7 54.2,78.9 R23.2
$1N14060: length 2.8
  Top Layer w0.254: R21.1 58,77.7 58.2,77.9 59.55,77.9 LED6.1
$1N14396: length 31.1
  Top Layer w0.254: Q3.3 72.8,78.7 72.5,78.4 D5.2
  Top Layer w0.7: 76.1,82.5 75.4,83.2 v1(75.4,85) ; 76.1,82.5 75.4,81.8 Q3.3 ; 76.1,82.5 87.8,82.5 88.4,81.9 LED7.2
  Bottom Layer w0.7: v1(75.4,85) 75.9,85.5 RLY3.4
$1N14403: length 7.4
  Top Layer w0.254: R30.2 83,78.9 82.8,78.7 80.5,78.7 80.3,78.5 R32.1 80.25,77.75 Q3.1
$1N14404: length 2.8
  Top Layer w0.254: R28.1 86.8,77.7 87,77.9 88.35,77.9 LED7.1
$1N14740: length 31.3
  Top Layer w0.254: D6.2 101.3,78.4 101.6,78.7 Q4.3
  Top Layer w0.7: 104.7,82.6 104.2,83.1 v1(104.2,84.8) ; 104.7,82.6 104.2,82.1 Q4.3 ; 104.7,82.6 116.7,82.6 117.2,82.1 LED8.2
  Bottom Layer w0.7: v1(104.2,84.8) 104.2,87.3 104.9,88 RLY4.4
$1N14747: length 7.4
  Top Layer w0.254: Q4.1 109.05,77.75 R33.1 109.1,78.5 109.3,78.7 111.6,78.7 111.8,78.9 R31.2
$1N14748: length 2.8
  Top Layer w0.254: R29.1 115.6,77.7 115.8,77.9 117.15,77.9 LED8.1
$1N15084: length 31.3
  Top Layer w0.254: D8.2 130.7,78.4 131,78.7 Q5.3
  Top Layer w0.7: v1(133.6,84.1) 133.6,83.3 134.2,82.7 ; 134.2,82.7 146.1,82.7 146.6,82.2 LED9.2 ; 134.2,82.7 133.6,82.1 Q5.3
  Bottom Layer w0.7: v1(133.6,84.1) 133.6,85.7 133.9,86 RLY5.4
$1N15091: length 7.4
  Top Layer w0.254: R46.2 141.2,78.9 141,78.7 138.7,78.7 138.5,78.5 R48.1 138.45,77.75 Q5.1
$1N15092: length 2.8
  Top Layer w0.254: LED9.1 146.55,77.9 145.2,77.9 145,77.7 R39.1
$1N15428: length 31.5
  Top Layer w0.254: D9.2 159.2,78.4 159.5,78.7 Q6.3
  Top Layer w0.7: 162.7,82.8 162.1,83.4 v1(162.1,84.8) ; 162.7,82.8 174.5,82.8 175.1,82.2 LED10.2 ; 162.7,82.8 162.7,82.6 162.1,82 Q6.3
  Bottom Layer w0.7: v1(162.1,84.8) 162.1,87.2 162.9,88 RLY6.4
$1N15435: length 7.4
  Top Layer w0.254: Q6.1 166.95,77.75 R49.1 167,78.5 167.2,78.7 169.5,78.7 169.7,78.9 R47.2
$1N15436: length 2.8
  Top Layer w0.254: LED10.1 175.05,77.9 173.7,77.9 173.5,77.7 R40.1
$1N20099: length 11.1
  Top Layer w0.7: F3.2 v1(120.8,17.3)
  Bottom Layer w0.7: v1(120.8,17.3) 120.8,10.55 P7.1
$1N20103: length 11.1
  Top Layer w0.7: F4.2 v1(111.2,17.3)
  Bottom Layer w0.7: v1(111.2,17.3) 111.2,10.51 P7.2
$1N20325: length 13.4
  Top Layer w0.7: F5.1 v1(157.3,16.7)
  Bottom Layer w0.7: v1(157.3,16.7) 157.3,14.9 156.9,14.5 155.7,14.5 155.25,14.05 P6.2
$1N32249: length 7.6
  Bottom Layer w0.254: D10.2 15.52,37.92 15.1,37.5 15.1,35.23 C21.2 15.08,31.98 U22.3
$1N32659: length 2.8
  Bottom Layer w0.254: R50.1 LED12.1

## Copper pours and planes (outline as drawn; the poured copper is in the pictures)
+5V on Top Layer: 0,132 0.01,132.34 0.06,132.78 0.15,133.22 0.28,133.65 0.45,134.07 0.65,134.47 0.89,134.85 1.16,135.2 1.46,135.54 1.8,135.84 2.15,136.11 2.53,136.35 2.93,136.55 3.35,136.72 3.78,136.85 4.22,136.94 4.66,136.99 5,137 186,137 186.34,136.99 186.78,136.94 187.22,136.85 187.65,136.72 188.07,136.55 188.47,136.35 188.85,136.11 189.2,135.84 189.54,135.54 189.84,135.2 190.11,134.85 190.35,134.47 190.55,134.07 190.72,133.65 190.85,133.22 190.94,132.78 190.99,132.34 191,132 191,5 190.99,4.66 190.94,4.22 190.85,3.78 190.72,3.35 190.55,2.93 190.35,2.53 190.11,2.15 189.84,1.8 189.54,1.46 189.2,1.16 188.85,0.89 188.47,0.65 188.07,0.45 187.65,0.28 187.22,0.15 186.78,0.06 186.34,0.01 186,0 5,0 4.66,0.01 4.22,0.06 3.78,0.15 3.35,0.28 2.93,0.45 2.53,0.65 2.15,0.89 1.8,1.16 1.46,1.46 1.16,1.8 0.89,2.15 0.65,2.53 0.45,2.93 0.28,3.35 0.15,3.78 0.06,4.22 0.01,4.66 0,5
GND on Bottom Layer: 0,132 0.01,132.34 0.06,132.78 0.15,133.22 0.28,133.65 0.45,134.07 0.65,134.47 0.89,134.85 1.16,135.2 1.46,135.54 1.8,135.84 2.15,136.11 2.53,136.35 2.93,136.55 3.35,136.72 3.78,136.85 4.22,136.94 4.66,136.99 5,137 186,137 186.34,136.99 186.78,136.94 187.22,136.85 187.65,136.72 188.07,136.55 188.47,136.35 188.85,136.11 189.2,135.84 189.54,135.54 189.84,135.2 190.11,134.85 190.35,134.47 190.55,134.07 190.72,133.65 190.85,133.22 190.94,132.78 190.99,132.34 191,132 191,5 190.99,4.66 190.94,4.22 190.85,3.78 190.72,3.35 190.55,2.93 190.35,2.53 190.11,2.15 189.84,1.8 189.54,1.46 189.2,1.16 188.85,0.89 188.47,0.65 188.07,0.45 187.65,0.28 187.22,0.15 186.78,0.06 186.34,0.01 186,0 5,0 4.66,0.01 4.22,0.06 3.78,0.15 3.35,0.28 2.93,0.45 2.53,0.65 2.15,0.89 1.8,1.16 1.46,1.46 1.16,1.8 0.89,2.15 0.65,2.53 0.45,2.93 0.28,3.35 0.15,3.78 0.06,4.22 0.01,4.66 0,5

## Text on the board
Top Silkscreen Layer: SIG | SDA | VCC | GND | SCL | 8V+ | POWER COM | POWER NO | STARTER COM | STARTER NO | IN+ | VIN12V | IN- | T+ | MAX6675 | COM3 | NO3 | COM4 | A | NO4 | RS485 | COM5 | B | INA- | NO5 | INA219 | COM6 | INA+ | NO6 | VIN | VSENS | LCD | PROXIMITY | MAGNETIC FUEL | 5V | SUPPLY | GAS LEVEL
